# EAGLE board tex (EAGLE 7.7.0), part 1 of 2
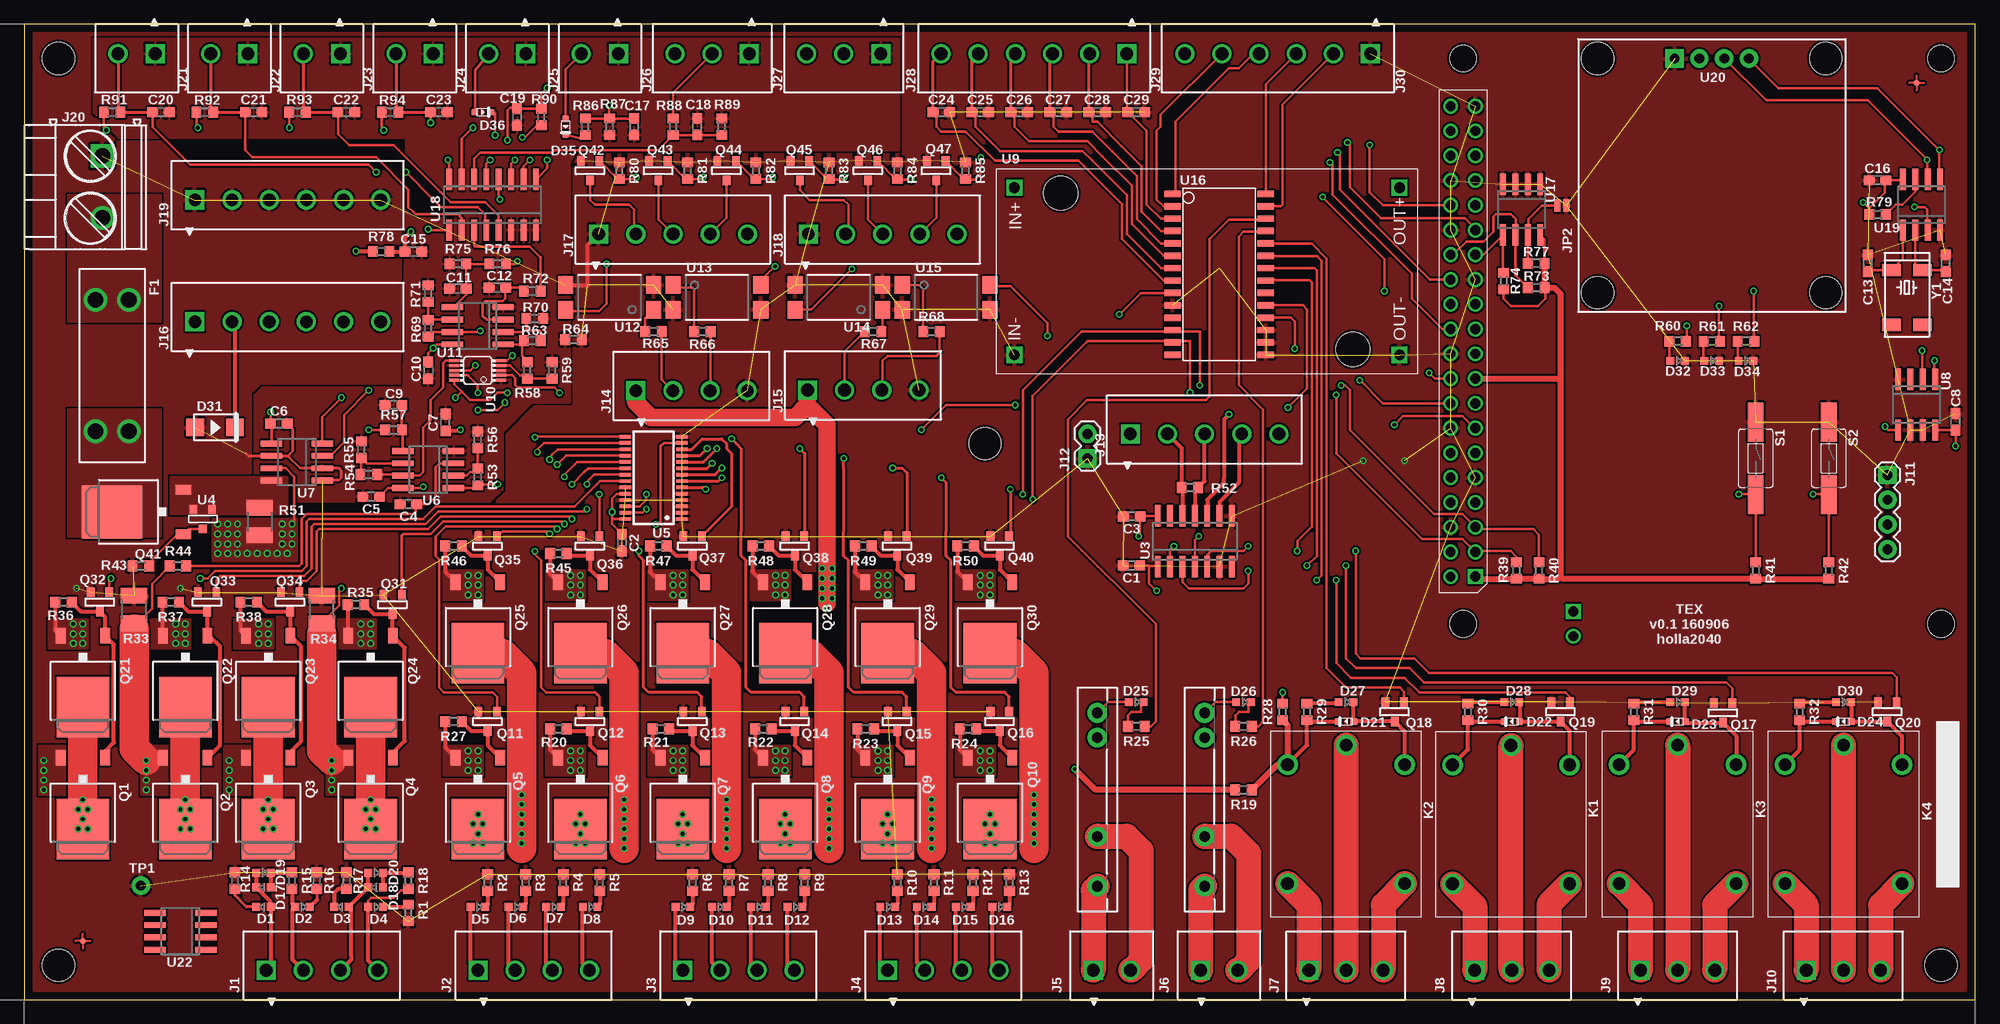
[diagram p7: board, top side]
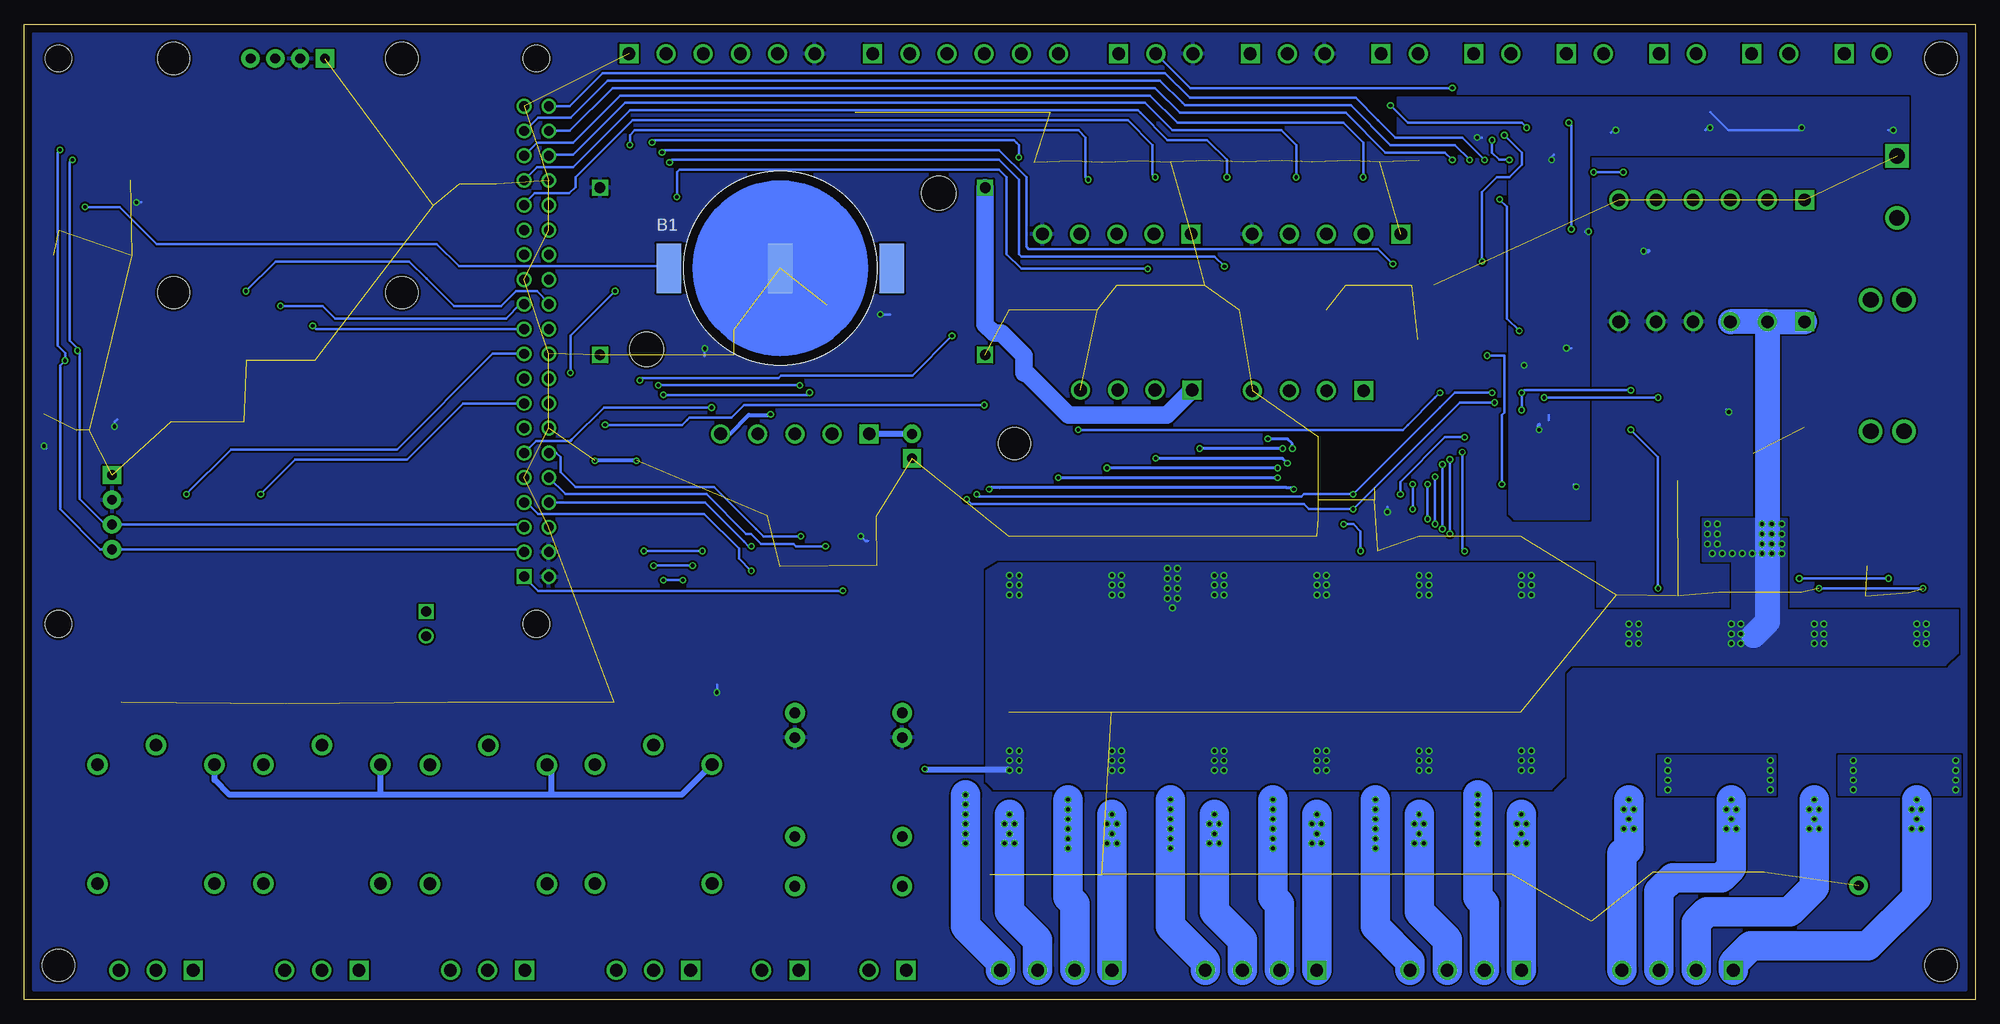
[diagram p8: board, bottom side, seen from below]

Size 200 x 100 mm. Coordinates in mm from the lower left corner, seen from the top.
Outline: 0,0 200,0 200,100 0,100 0,0
Copper layers (1*16): Top 0.035mm / dielectric 1.5mm / Bottom 0.035mm
Design rules "CircuitGraphics_DRC": minimum track width 8mil, minimum drill 12mil, track to track 8mil, track to pad 8mil, pad to pad 8mil, via to via 8mil, smd to smd 0mil, copper to edge 10mil, drill to drill 12mil, minimum pad ring 10mil, minimum via ring 6mil, stop-mask expansion 2mil, vias tented up to drill 100mil, thermal gap 10mil
Holes 3.3 mm at 3.5,3.5 3.5,96.5 196.5,3.5 98.5,57
tKeepout: area 0.5,0.5 to 6.5,6.5; area 0.5,93.5 to 6.5,99.5; area 193.5,0.5 to 199.5,6.5; area 193.5,93.5 to 199.5,99.5; area 95.5,54 to 101.5,60

## Footprints (pad centres in the part's own frame; a part is rotated, then mirrored left to right if it is on the bottom)
BAT-HLD-001 = smd 2.54 x 5.08: +1 -11.43,0; +2 11.43,0; - 0,0
C0603 = smd 1.1 x 1: 1 -0.85,0; 2 0.85,0
LED0603 = smd 0.8 x 0.8: A 0,-0.75; C 0,0.75
SOD-523 = smd 0.762 x 0.7: A -0.8,0; C 0.8,0
DO-214AC(SMA) = smd 1.8 x 1.77: A -2.042,0; C 2.042,0
3557-2 = drill 1.6: 1@1 -6.731,-1.702; 1@2 -6.731,1.702; 2@1 6.731,-1.702; 2@2 6.731,1.702
CONN-3.81MM-KF2EDG-4 = drill 1.3 square: 1 -5.715,0 | drill 1.3: 2 -1.905,0; 3 1.905,0; 4 5.715,0
CONN-3.81MM-KF2EDG-2 = drill 1.3 square: 1 -1.905,0 | drill 1.3: 2 1.905,0
CONN-3.81MM-KF2EDG-3 = drill 1.3 square: 1 -3.81,0 | drill 1.3: 2 0,0; 3 3.81,0
1X04 = drill 1.016 pad 1.88 square: 1 0,0 | drill 1.016 pad 1.88: 2 2.54,0; 3 5.08,0; 4 7.62,0
1X02 = drill 1.016 pad 1.88 square: 1 0,0 | drill 1.016 pad 1.88: 2 2.5,0
CONN-3.81MM-KF2EDG-5 = drill 1.3 square: 1 -7.62,0 | drill 1.3: 2 -3.81,0; 3 0,0; 4 3.81,0; 5 7.62,0
CONN-3.81MM-KF2EDG-6 = drill 1.3 square: 1 -9.525,0 | drill 1.3: 2 -5.715,0; 3 -1.905,0; 4 1.905,0; 5 5.715,0; 6 9.525,0
CONN-OSTT702 = drill 1.6 square: 1 0,0 | drill 1.6: 2 6.35,0
MICRO-FIDUCIAL = smd 0.635 x 0.635: 1 0,0
PAD-JUMPER-2-NO_NO_SILK = smd 0.635 x 1.27: 1 -0.45,0; 2 0.45,0
RELAY-SPST-19.0X15.0X15.0MM = drill 1.3 pad 2.1: 1 -8.1,0; 2 -6.1,-6; 3 -6.1,6; 4 6.1,-6; 5 6.1,6
BOARD-RPI2 = drill 1.016 square: P$1 8.37,51.23; P$41 4.8,41.2 | drill 1.016: P$2 8.357,53.772; P$3 10.897,51.232; P$4 10.897,53.772; P$5 13.437,51.232; P$6 13.437,53.772; P$7 15.977,51.232; P$8 15.977,53.772; P$9 18.517,51.232; P$10 18.517,53.772; P$11 21.057,51.232; P$12 21.057,53.772; P$13 23.597,51.232; P$14 23.597,53.772; P$15 26.137,51.232; P$16 26.137,53.772; P$17 28.677,51.232; P$18 28.677,53.772; P$19 31.217,51.232; P$20 31.217,53.772; P$21 33.757,51.232; P$22 33.757,53.772; P$23 36.297,51.232; P$24 36.297,53.772; P$25 38.837,51.232; P$26 38.837,53.772; P$27 41.377,51.232; P$28 41.377,53.772; P$29 43.917,51.232; P$30 43.917,53.772; P$31 46.457,51.232; P$32 46.457,53.772; P$33 48.997,51.232; P$34 48.997,53.772; P$35 51.537,51.232; P$36 51.537,53.772; P$37 54.077,51.232; P$38 54.077,53.772; P$39 56.617,51.232; P$40 56.617,53.772; P$42 2.26,41.2 | hole 2.75: 3.5,3.5; 61.5,3.5; 3.5,52.5; 61.5,52.5
TO252 = smd 1 x 1.6: 1 -2.28,-4.8; 2 2.28,-4.8 | smd 5.4 x 6.2: 3 0,2.5
SOT23-3 = smd 0.8 x 0.972: 1 -0.95,-1; 2 0.95,-1; 3 0,1
R0603 = smd 1 x 1.1: 1 -0.85,0; 2 0.85,0
R1210 = smd 1.6 x 2.7: 1 -1.4,0; 2 1.4,0
TACTILE-SWITCH-6MMX3.5MM = smd 4 x 1.6: P$1 -3.7,0; P$2 3.7,0
TPTHRU = drill 1.016 pad 1.88: 1 0,0
RELAY-S108T02 = drill 1.1 pad 2.032: 1 -8.88,0; 2 -3.8,0; 3 6.36,0; 4 8.9,0
SO14 = smd 0.6 x 2.2: 1 -3.81,-2.6; 2 -2.54,-2.6; 3 -1.27,-2.6; 4 0,-2.6; 5 1.27,-2.6; 6 2.54,-2.6; 7 3.81,-2.6; 8 3.81,2.6; 9 2.54,2.6; 10 1.27,2.6; 11 0,2.6; 12 -1.27,2.6; 13 -2.54,2.6; 14 -3.81,2.6
SOT-23 = smd 0.8 x 0.9: 1 0,1; 2 -0.95,-1; 3 0.95,-1
TSSOP28 = smd 0.35 x 1.2: 1 -4.225,-2.9; 2 -3.575,-2.9; 3 -2.925,-2.9; 4 -2.275,-2.9; 5 -1.625,-2.9; 6 -0.975,-2.9; 7 -0.325,-2.9; 8 0.325,-2.9; 9 0.975,-2.9; 10 1.625,-2.9; 11 2.275,-2.9; 12 2.925,-2.9; 13 3.575,-2.9; 14 4.225,-2.9; 15 4.225,2.9; 16 3.575,2.9; 17 2.925,2.9; 18 2.275,2.9; 19 1.625,2.9; 20 0.975,2.9; 21 0.325,2.9; 22 -0.325,2.9; 23 -0.975,2.9; 24 -1.625,2.9; 25 -2.275,2.9; 26 -2.925,2.9; 27 -3.575,2.9; 28 -4.225,2.9
SO08 = smd 0.6 x 2.2: 1 -1.905,-2.6; 2 -0.635,-2.6; 3 0.635,-2.6; 4 1.905,-2.6; 5 1.905,2.6; 6 0.635,2.6; 7 -0.635,2.6; 8 -1.905,2.6
SOIC8 = smd 0.6 x 2.2: 1 -1.905,-2.6; 2 -0.635,-2.6; 3 0.635,-2.6; 4 1.905,-2.6; 5 1.905,2.6; 6 0.635,2.6; 7 -0.635,2.6; 8 -1.905,2.6
DCDC-LM2577-BOARD = drill 1.1 square: IN+ 1.841,19.114; IN- 1.841,1.968; OUT+ 41.339,19.114; OUT- 41.339,1.968 | hole 3.5: 6.604,18.542; 36.576,2.54
MSOP10_0.5 = smd 0.3 x 1.02: 1 -1,-2.4; 2 -0.5,-2.4; 3 0,-2.4; 4 0.5,-2.4; 5 1,-2.4; 6 1,2.4; 7 0.5,2.4; 8 0,2.4; 9 -0.5,2.4; 10 -1,2.4
LTV817 = smd 1.78 x 1.55: 1 -1.27,-4.5; 2 1.27,-4.5; 3 1.27,4.5; 4 -1.27,4.5
SO28W = smd 0.65 x 1.7: 1 -7.62,-4.78; 2 -6.35,-4.78; 3 -5.08,-4.78; 4 -3.81,-4.78; 5 -2.54,-4.78; 6 -1.27,-4.78; 7 0,-4.78; 8 1.27,-4.78; 9 2.54,-4.78; 10 3.81,-4.78; 11 5.08,-4.78; 12 6.35,-4.78; 13 7.62,-4.78; 14 8.89,-4.78; 15 8.89,4.78; 16 7.62,4.78; 17 6.35,4.78; 18 5.08,4.78; 19 3.81,4.78; 20 2.54,4.78; 21 1.27,4.78; 22 0,4.78; 23 -1.27,4.78; 24 -2.54,4.78; 25 -3.81,4.78; 26 -5.08,4.78; 27 -6.35,4.78; 28 -7.62,4.78
SO16 = smd 0.6 x 2.2: 1 -4.445,-2.6; 2 -3.175,-2.6; 3 -1.905,-2.6; 4 -0.635,-2.6; 5 0.635,-2.6; 6 1.905,-2.6; 7 3.175,-2.6; 8 4.445,-2.6; 9 4.445,2.6; 10 3.175,2.6; 11 1.905,2.6; 12 0.635,2.6; 13 -0.635,2.6; 14 -1.905,2.6; 15 -3.175,2.6; 16 -4.445,2.6
DISP-I2C-4PIN-0.96 = drill 1.016 pad 1.88 square: GND -3.81,0 | drill 1.016 pad 1.88: SCL 1.27,0; SDA 3.81,0; VCC -1.27,0 | hole 3.3: -11.7,0; 11.7,0; 11.7,-24; -11.7,-24
ABS25 = smd 1.27 x 1.905: 1 -2.794,-1.587; 2 2.794,-1.587; 3 2.794,1.587; 4 -2.794,1.587

## Placement (x,y rotation side)
B1  CR2032  [BAT-HLD-001]  122.5,75 0 bottom
C1  .1u  [C0603]  113.5,44.5 180 top
C2  .1u  [C0603]  61.25,46.84 270 top
C3  .1u  [C0603]  113.54,49.53 180 top
C4  .1u  [C0603]  39.37,50.8 180 top
C5  .1u  [C0603]  35.56,51.56 180 top
C6  .1u  [C0603]  26.09,59.07 0 top
C7  .1u  [C0603]  43.18,59.18 90 top
C8  .1u  [C0603]  198,59.25 90 top
C9  .1u  [C0603]  37.85,60.96 180 top
C10  .1u  [C0603]  41.4,64.52 270 top
C11  .1u  [C0603]  44.45,72.9 180 top
C12  .1u  [C0603]  48.5,73 180 top
C13  6p  [C0603]  189,75.5 90 top
C14  6p  [C0603]  197,75.5 90 top
C15  .1u  [C0603]  39.88,76.71 0 top
C16  .1u  [C0603]  190,84 180 top
C17  .1u  [C0603]  62.5,89.5 270 top
C18  .1u  [C0603]  69,89.5 90 top
C19  .1u  [C0603]  50.5,90.5 270 top
C20  .1u  [C0603]  14,91 0 top
C21  .1u  [C0603]  23.5,91 0 top
C22  .1u  [C0603]  33,91 0 top
C23  .1u  [C0603]  42.5,91 0 top
C24  .1u  [C0603]  94,91 0 top
C25  .1u  [C0603]  98,91 0 top
C26  .1u  [C0603]  102,91 0 top
C27  .1u  [C0603]  106,91 0 top
C28  .1u  [C0603]  110,91 0 top
C29  .1u  [C0603]  114,91 0 top
D1  GRN  [LED0603]  24.5,9.5 90 top
D2  GRN  [LED0603]  28.5,9.5 270 top
D3  GRN  [LED0603]  32.5,9.5 90 top
D4  GRN  [LED0603]  36,9.5 270 top
D5  GRN  [LED0603]  46.5,9.5 270 top
D6  GRN  [LED0603]  50.38,9.5 270 top
D7  GRN  [LED0603]  54.25,9.5 270 top
D8  GRN  [LED0603]  58,9.5 270 top
D9  GRN  [LED0603]  67.5,9.5 270 top
D10  GRN  [LED0603]  71.25,9.5 270 top
D11  GRN  [LED0603]  75.25,9.5 270 top
D12  GRN  [LED0603]  79,9.5 270 top
D13  GRN  [LED0603]  88.5,9.5 270 top
D14  GRN  [LED0603]  92.25,9.5 270 top
D15  GRN  [LED0603]  96.25,9.5 270 top
D16  GRN  [LED0603]  100,9.5 270 top
D17  RED  [LED0603]  24.5,11.5 90 top
D18  RED  [LED0603]  36,11.5 90 top
D19  GRN  [LED0603]  24.5,13 270 top
D20  GRN  [LED0603]  36,13 270 top
D21  1n4148  [SOD-523]  135.5,28.5 180 top
D22  1n4148  [SOD-523]  152.5,28.5 180 top
D23  1n4148  [SOD-523]  169.5,28.5 180 top
D24  1n4148  [SOD-523]  186.5,28.5 180 top
D25  GRN  [LED0603]  114,30.5 270 top
D26  GRN  [LED0603]  125,30.5 270 top
D27  GRN  [LED0603]  135.5,30.5 270 top
D28  GRN  [LED0603]  152.5,30.5 270 top
D29  GRN  [LED0603]  169.5,30.5 270 top
D30  GRN  [LED0603]  186.5,30.5 270 top
D31  VZ=15.0  [DO-214AC(SMA)]  19.56,58.67 0 top
D32  GRN  [LED0603]  169.5,65.5 270 top
D33  RED  [LED0603]  173,65.5 270 top
D34  BLUE  [LED0603]  176.5,65.5 270 top
D35  1n4148  [SOD-523]  55.5,89.5 270 top
D36  1n4148  [SOD-523]  47,91 0 top
F1  10A  [3557-2]  9,65 270 top
J1  [CONN-3.81MM-KF2EDG-4]  30.5,3 0 top
J2  [CONN-3.81MM-KF2EDG-4]  52.22,3 0 top
J3  [CONN-3.81MM-KF2EDG-4]  73.22,3 0 top
J4  [CONN-3.81MM-KF2EDG-4]  94.22,3 0 top
J5  [CONN-3.81MM-KF2EDG-2]  111.5,3 0 top
J6  [CONN-3.81MM-KF2EDG-2]  122.5,3 0 top
J7  [CONN-3.81MM-KF2EDG-3]  135.5,3 0 top
J8  [CONN-3.81MM-KF2EDG-3]  152.5,3 0 top
J9  [CONN-3.81MM-KF2EDG-3]  169.5,3 0 top
J10  [CONN-3.81MM-KF2EDG-3]  186.5,3 0 top
J11  [1X04]  191.02,53.79 270 top
J12  [1X02]  109,55.5 90 top
J13  [CONN-3.81MM-KF2EDG-5]  121,58 0 top
J14  [CONN-3.81MM-KF2EDG-4]  68.39,62.43 0 top
J15  [CONN-3.81MM-KF2EDG-4]  86,62.5 0 top
J16  [CONN-3.81MM-KF2EDG-6]  27,69.5 0 top
J17  [CONN-3.81MM-KF2EDG-5]  66.5,78.5 0 top
J18  [CONN-3.81MM-KF2EDG-5]  88,78.5 0 top
J19  [CONN-3.81MM-KF2EDG-6]  27,82 0 top
J20  [CONN-OSTT702]  8,86.5 270 top
J21  [CONN-3.81MM-KF2EDG-2]  11.5,97 180 top
J22  [CONN-3.81MM-KF2EDG-2]  21,97 180 top
J23  [CONN-3.81MM-KF2EDG-2]  30.5,97 180 top
J24  [CONN-3.81MM-KF2EDG-2]  40,97 180 top
J25  [CONN-3.81MM-KF2EDG-2]  49.5,97 180 top
J26  [CONN-3.81MM-KF2EDG-2]  59,97 180 top
J27  [CONN-3.81MM-KF2EDG-3]  70.5,97 180 top
J28  [CONN-3.81MM-KF2EDG-3]  84,97 180 top
J29  [CONN-3.81MM-KF2EDG-6]  103.5,97 180 top
J30  [CONN-3.81MM-KF2EDG-6]  128.5,97 180 top
JP1  FIDUCIALUFIDUCIAL  [MICRO-FIDUCIAL]  6,6 0 top
JP2  DNP  [PAD-JUMPER-2-NO_NO_SILK]  157.63,81.42 180 top
JP3  FIDUCIALUFIDUCIAL  [MICRO-FIDUCIAL]  194,94 0 top
K1  [RELAY-SPST-19.0X15.0X15.0MM]  152.41,17.96 270 top
K2  [RELAY-SPST-19.0X15.0X15.0MM]  135.5,18 270 top
K3  [RELAY-SPST-19.0X15.0X15.0MM]  169.5,18 270 top
K4  [RELAY-SPST-19.0X15.0X15.0MM]  186.5,18 270 top
PCB1  BOARD-RPI2  [BOARD-RPI2]  200,35 90 top
Q1  FET-NCH  [TO252]  6,20 180 top
Q2  FET-NCH  [TO252]  16.5,20 180 top
Q3  FET-NCH  [TO252]  25,20 180 top
Q4  FET-NCH  [TO252]  35.5,20 180 top
Q5  FET-PCH  [TO252]  46.5,20 180 top
Q6  FET-PCH  [TO252]  57,20 180 top
Q7  FET-PCH  [TO252]  67.5,20 180 top
Q8  FET-PCH  [TO252]  78,20 180 top
Q9  FET-PCH  [TO252]  88.5,20 180 top
Q10  FET-PCH  [TO252]  99,20 180 top
Q11  FET-NCH  [SOT23-3]  47.5,28.5 180 top
Q12  FET-NCH  [SOT23-3]  58,28.5 180 top
Q13  FET-NCH  [SOT23-3]  68.5,28.5 180 top
Q14  FET-NCH  [SOT23-3]  79,28.5 180 top
Q15  FET-NCH  [SOT23-3]  89.5,28.5 180 top
Q16  FET-NCH  [SOT23-3]  100,28.5 180 top
Q17  FET-NCH  [SOT23-3]  174.16,29.39 180 top
Q18  FET-NCH  [SOT23-3]  140.5,29.5 180 top
Q19  FET-NCH  [SOT23-3]  157.5,29.5 180 top
Q20  FET-NCH  [SOT23-3]  191,29.5 180 top
Q21  FET-PCH  [TO252]  6,32.5 180 top
Q22  FET-PCH  [TO252]  16.5,32.5 180 top
Q23  FET-PCH  [TO252]  25,32.5 180 top
Q24  FET-PCH  [TO252]  35.5,32.5 180 top
Q25  FET-PCH  [TO252]  46.5,38 180 top
Q26  FET-PCH  [TO252]  57,38 180 top
Q27  FET-PCH  [TO252]  67.5,38 180 top
Q28  FET-PCH  [TO252]  78,38 180 top
Q29  FET-PCH  [TO252]  88.5,38 180 top
Q30  FET-PCH  [TO252]  99,38 180 top
Q31  FET-NCH  [SOT23-3]  37.75,40.5 180 top
Q32  FET-NCH  [SOT23-3]  7.75,40.75 180 top
Q33  FET-NCH  [SOT23-3]  18.75,40.75 180 top
Q34  FET-NCH  [SOT23-3]  27.25,40.75 180 top
Q35  FET-NCH  [SOT23-3]  47.5,46.5 180 top
Q36  FET-NCH  [SOT23-3]  58,46.5 180 top
Q37  FET-NCH  [SOT23-3]  68.5,46.5 180 top
Q38  FET-NCH  [SOT23-3]  79,46.5 180 top
Q39  FET-NCH  [SOT23-3]  89.5,46.5 180 top
Q40  FET-NCH  [SOT23-3]  100,46.5 180 top
Q41  FET-PCH  [TO252]  11.5,50 90 top
Q42  FET-NCH  [SOT23-3]  58,85 180 top
Q43  FET-NCH  [SOT23-3]  65,85 180 top
Q44  FET-NCH  [SOT23-3]  72,85 180 top
Q45  FET-NCH  [SOT23-3]  79.5,85 180 top
Q46  FET-NCH  [SOT23-3]  86.5,85 180 top
Q47  FET-NCH  [SOT23-3]  93.5,85 180 top
R1  1k  [R0603]  39.37,8.89 90 top
R2  1k  [R0603]  47.5,12 270 top
R3  1k  [R0603]  51.38,12 270 top
R4  1k  [R0603]  55.25,12 270 top
R5  1k  [R0603]  59,12 270 top
R6  1k  [R0603]  68.5,12 270 top
R7  1k  [R0603]  72.25,12 270 top
R8  1k  [R0603]  76.25,12 270 top
R9  1k  [R0603]  80,12 270 top
R10  1k  [R0603]  89.5,12 270 top
R11  1k  [R0603]  93.25,12 270 top
R12  1k  [R0603]  97.25,12 270 top
R13  1k  [R0603]  101,12 270 top
R14  1k  [R0603]  21.59,12.19 270 top
R15  1k  [R0603]  27.43,12.19 270 top
R16  1k  [R0603]  29.97,12.19 270 top
R17  1k  [R0603]  33.02,12.19 270 top
R18  1k  [R0603]  39.37,12.19 270 top
R19  0  [R0603]  125,21.5 180 top
R20  47k  [R0603]  54.75,27.75 180 top
R21  47k  [R0603]  65.25,27.75 180 top
R22  47k  [R0603]  75.75,27.75 180 top
R23  47k  [R0603]  86.25,27.75 180 top
R24  47k  [R0603]  96.75,27.75 180 top
R25  220  [R0603]  114,28 180 top
R26  220  [R0603]  125,28 180 top
R27  47k  [R0603]  44,28.5 180 top
R28  DNP  [R0603]  129,29.5 90 top
R29  1k  [R0603]  131.5,29.5 270 top
R30  1k  [R0603]  148,29.5 270 top
R31  1k  [R0603]  165,29.5 270 top
R32  1k  [R0603]  182,29.5 270 top
R33  0.1  [R1210]  11.25,40 90 top
R34  0.1  [R1210]  30.5,40 90 top
R35  47k  [R0603]  34,40.5 180 top
R36  47k  [R0603]  4,40.75 180 top
R37  47k  [R0603]  15,40.75 180 top
R38  47k  [R0603]  23,40.75 180 top
R39  1k  [R0603]  152.97,44 270 top
R40  1k  [R0603]  155.29,44 270 top
R41  47k  [R0603]  177.5,44 270 top
R42  47k  [R0603]  185,44 270 top
R43  47k  [R0603]  11.94,44.45 180 top
R44  1k  [R0603]  15.75,44.45 0 top
R45  47k  [R0603]  54.75,45.75 180 top
R46  47k  [R0603]  44,46.5 180 top
R47  47k  [R0603]  65,46.5 180 top
R48  47k  [R0603]  75.5,46.5 180 top
R49  47k  [R0603]  86,46.5 180 top
R50  47k  [R0603]  96.5,46.5 180 top
R51  0.1  [R1210]  24.13,49.02 270 top
R52  120  [R0603]  119.5,52.5 180 top
R53  10k  [R0603]  46.48,53.59 270 top
R54  10k  [R0603]  35.31,53.85 0 top
R55  1k  [R0603]  34.54,56.39 270 top
R56  1k  [R0603]  46.48,57.4 270 top
R57  1k  [R0603]  37.85,58.42 0 top
R58  1k  [R0603]  51.56,64.52 90 top
R59  1k  [R0603]  54.1,64.52 270 top
R60  220  [R0603]  169.5,67.5 0 top
R61  220  [R0603]  173,67.5 0 top
R62  220  [R0603]  176.5,67.5 0 top
R63  0  [R0603]  52.07,67.56 180 top
R64  0  [R0603]  56.3,67.67 180 top
R65  1k  [R0603]  64.5,68.5 0 top
R66  1k  [R0603]  69.5,68.5 0 top
R67  1k  [R0603]  87,68.5 180 top
R68  1k  [R0603]  93,68.5 0 top
R69  10k  [R0603]  41.4,68.83 270 top
R70  DNP  [R0603]  52.32,69.85 180 top
R71  1k  [R0603]  41.4,72.39 270 top
R72  1k  [R0603]  52.07,72.64 180 top
R73  1k  [R0603]  155,73 0 top
R74  1k  [R0603]  151.66,73.67 270 top
R75  DNP  [R0603]  44.45,75.44 0 top
R76  10k  [R0603]  48.51,75.44 0 top
R77  1k  [R0603]  155,75.5 0 top
R78  120  [R0603]  36.58,76.71 0 top
R79  120  [R0603]  190,80.5 180 top
R80  47k  [R0603]  61,85 270 top
R81  47k  [R0603]  68,85 270 top
R82  47k  [R0603]  75,85 270 top
R83  47k  [R0603]  82.5,85 270 top
R84  47k  [R0603]  89.5,85 270 top
R85  47k  [R0603]  96.5,85 270 top
R86  47k  [R0603]  57.5,89.5 270 top
R87  10k  [R0603]  60,89.5 90 top
R88  47k  [R0603]  66.5,89.5 90 top
R89  10k  [R0603]  71.5,89.5 270 top
R90  10k  [R0603]  53,90.5 270 top
R91  10k  [R0603]  9,91 180 top
R92  10k  [R0603]  18.5,91 180 top
R93  10k  [R0603]  28,91 180 top
R94  10k  [R0603]  37.5,91 180 top
S1  UI  [TACTILE-SWITCH-6MMX3.5MM]  177.5,55.5 270 top
S2  UI  [TACTILE-SWITCH-6MMX3.5MM]  185,55.5 270 top
TP1  [TPTHRU]  11.94,11.68 0 top
U1  [RELAY-S108T02]  110,20.5 90 top
U2  [RELAY-S108T02]  121,20.5 90 top
U3  MAX13433E  [SO14]  120,47 0 top
U4  AZ23C5V1  [SOT-23]  18.29,49.28 180 top
U5  PCA9685  [TSSOP28]  64.5,53.5 90 top
U6  DUALOPAMP  [SO08]  41.4,54.36 90 top
U7  INA219  [SOIC8]  27.94,55.12 90 top
U8  LM75  [SO08]  194,61 180 top
U9  [DCDC-LM2577-BOARD]  99.65,64.14 0 top
U10  ADS1x15  [MSOP10_0.5]  46.48,64.52 90 top
U11  DUALOPAMP  [SO08]  46.48,69.09 90 top
U12  OPTO  [LTV817]  60,72 90 top
U13  OPTO  [LTV817]  71,72 270 top
U14  OPTO  [LTV817]  83.5,72 90 top
U15  OPTO  [LTV817]  94.5,72 270 top
U16  MCP23017  [SO28W]  122.5,75 270 top
U17  24LC32A  [SO08]  153.5,81 180 top
U18  IO-HC4051  [SO16]  48,81.5 0 top
U19  MCP7940N  [SO08]  194.5,81.5 0 top
U20  [DISP-I2C-4PIN-0.96]  173,96.5 0 top
U22  DUALOPAMP  [SO08]  16,7 90 top
Y1  32.768KHz  [ABS25]  193,72 270 top